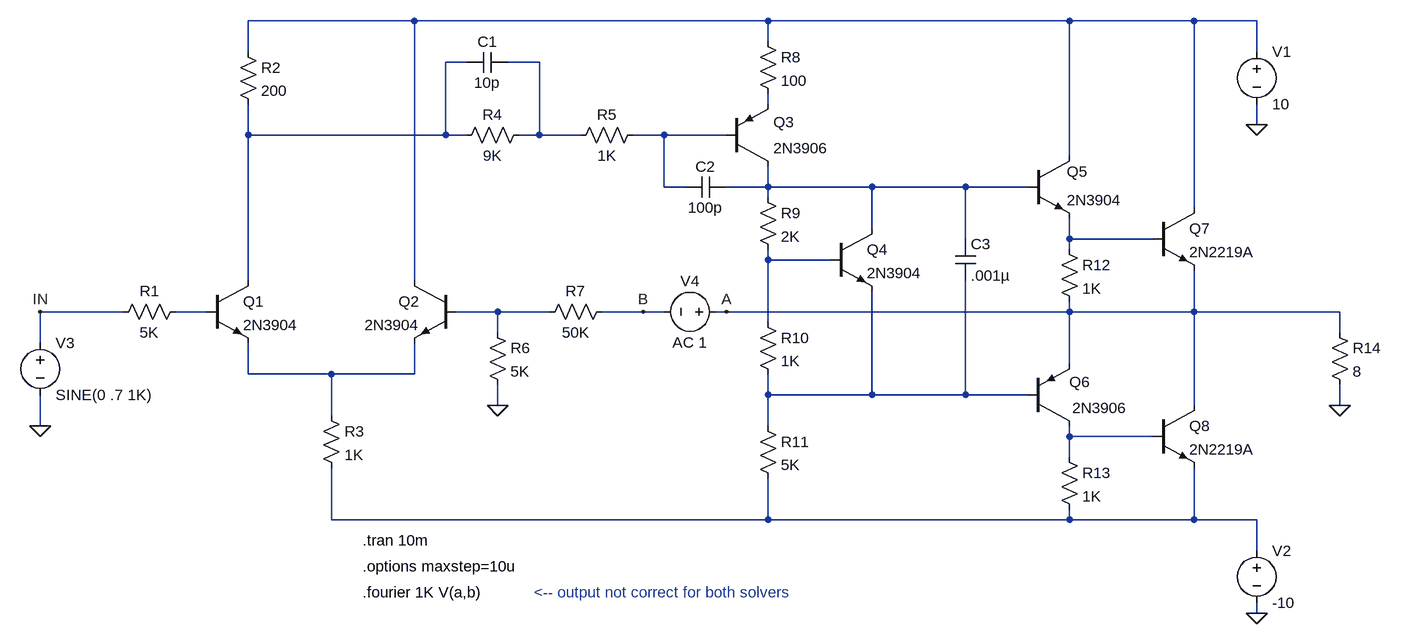
[diagram p0: schematic SolverIssue.asc]
SolverIssue.asc, the LTspice schematic file:
Version 4
SHEET 1 2352 2032
WIRE 848 912 592 912
WIRE 1392 912 848 912
WIRE 1856 912 1392 912
WIRE 2048 912 1856 912
WIRE 2144 912 2048 912
WIRE 1392 944 1392 912
WIRE 592 960 592 912
WIRE 2144 960 2144 912
WIRE 928 976 896 976
WIRE 1040 976 992 976
WIRE 1392 1040 1392 1024
WIRE 2144 1072 2144 1040
WIRE 592 1088 592 1040
WIRE 896 1088 896 976
WIRE 896 1088 592 1088
WIRE 928 1088 896 1088
WIRE 1040 1088 1040 976
WIRE 1040 1088 1008 1088
WIRE 1104 1088 1040 1088
WIRE 1232 1088 1184 1088
WIRE 1328 1088 1232 1088
WIRE 1856 1120 1856 912
WIRE 1232 1168 1232 1088
WIRE 1264 1168 1232 1168
WIRE 1392 1168 1392 1136
WIRE 1392 1168 1328 1168
WIRE 1552 1168 1392 1168
WIRE 1696 1168 1552 1168
WIRE 1792 1168 1696 1168
WIRE 1392 1184 1392 1168
WIRE 2048 1200 2048 912
WIRE 1552 1232 1552 1168
WIRE 1696 1248 1696 1168
WIRE 1856 1248 1856 1216
WIRE 1984 1248 1856 1248
WIRE 1856 1264 1856 1248
WIRE 1392 1280 1392 1264
WIRE 1488 1280 1392 1280
WIRE 592 1312 592 1088
WIRE 848 1312 848 912
WIRE 400 1360 272 1360
WIRE 528 1360 480 1360
WIRE 976 1360 912 1360
WIRE 1056 1360 976 1360
WIRE 1200 1360 1136 1360
WIRE 1232 1360 1200 1360
WIRE 1328 1360 1312 1360
WIRE 1856 1360 1856 1344
WIRE 1856 1360 1328 1360
WIRE 2048 1360 2048 1296
WIRE 2048 1360 1856 1360
WIRE 2272 1360 2048 1360
WIRE 1392 1376 1392 1280
WIRE 976 1392 976 1360
WIRE 2272 1392 2272 1360
WIRE 272 1408 272 1360
WIRE 1856 1440 1856 1360
WIRE 592 1456 592 1408
WIRE 720 1456 592 1456
WIRE 848 1456 848 1408
WIRE 848 1456 720 1456
WIRE 1392 1488 1392 1456
WIRE 1552 1488 1552 1328
WIRE 1552 1488 1392 1488
WIRE 1696 1488 1696 1312
WIRE 1696 1488 1552 1488
WIRE 1792 1488 1696 1488
WIRE 976 1504 976 1472
WIRE 2048 1504 2048 1360
WIRE 2272 1504 2272 1472
WIRE 720 1520 720 1456
WIRE 272 1536 272 1488
WIRE 1392 1536 1392 1488
WIRE 1856 1552 1856 1536
WIRE 1984 1552 1856 1552
WIRE 1856 1584 1856 1552
WIRE 720 1680 720 1600
WIRE 1392 1680 1392 1616
WIRE 1392 1680 720 1680
WIRE 1856 1680 1856 1664
WIRE 1856 1680 1392 1680
WIRE 2048 1680 2048 1600
WIRE 2048 1680 1856 1680
WIRE 2144 1680 2048 1680
WIRE 2144 1728 2144 1680
WIRE 2144 1824 2144 1808
FLAG 2144 1072 0
FLAG 2144 1824 0
FLAG 2272 1504 0
FLAG 976 1504 0
FLAG 272 1536 0
FLAG 1328 1360 A
FLAG 1200 1360 B
FLAG 272 1360 IN
SYMBOL NPN 1792 1120 R0
WINDOW 0 60 24 Left 2
WINDOW 3 60 68 Left 2
SYMATTR InstName Q5
SYMATTR Value 2N3904
SYMBOL npn 1984 1200 R0
SYMATTR InstName Q7
SYMATTR Value 2N2219A
SYMBOL npn 1984 1504 R0
SYMATTR InstName Q8
SYMATTR Value 2N2219A
SYMBOL PNP 1792 1536 M180
WINDOW 0 64 68 Left 2
WINDOW 3 68 28 Left 2
SYMATTR InstName Q6
SYMATTR Value 2N3906
SYMBOL VOLTAGE 2144 944 R0
SYMATTR InstName V1
SYMATTR Value 10
SYMBOL voltage 2144 1712 R0
SYMATTR InstName V2
SYMATTR Value -10
SYMBOL RES 1376 1520 R0
SYMATTR InstName R11
SYMATTR Value 5K
SYMBOL res 2256 1376 R0
SYMATTR InstName R14
SYMATTR Value 8
SYMBOL res 1376 1168 R0
SYMATTR InstName R9
SYMATTR Value 2K
SYMBOL res 1376 1360 R0
SYMATTR InstName R10
SYMATTR Value 1K
SYMBOL npn 1488 1232 R0
SYMATTR InstName Q4
SYMATTR Value 2N3904
SYMBOL npn 528 1312 R0
SYMATTR InstName Q1
SYMATTR Value 2N3904
SYMBOL npn 912 1312 M0
SYMATTR InstName Q2
SYMATTR Value 2N3904
SYMBOL res 576 944 R0
SYMATTR InstName R2
SYMATTR Value 200
SYMBOL res 704 1504 R0
SYMATTR InstName R3
SYMATTR Value 1K
SYMBOL pnp 1328 1136 M180
WINDOW 0 72 68 Left 2
WINDOW 3 72 28 Left 2
SYMATTR InstName Q3
SYMATTR Value 2N3906
SYMBOL res 960 1376 R0
SYMATTR InstName R6
SYMATTR Value 5K
SYMBOL res 1152 1344 R90
WINDOW 0 0 56 VBottom 2
WINDOW 3 32 56 VTop 2
SYMATTR InstName R7
SYMATTR Value 50K
SYMBOL voltage 272 1392 R0
SYMATTR InstName V3
SYMATTR Value SINE(0 .7 1K)
SYMBOL res 496 1344 R90
WINDOW 0 0 56 VBottom 2
WINDOW 3 32 56 VTop 2
SYMATTR InstName R1
SYMATTR Value 5K
SYMBOL res 1376 928 R0
SYMATTR InstName R8
SYMATTR Value 100
SYMBOL res 1024 1072 R90
WINDOW 0 0 56 VBottom 2
WINDOW 3 32 56 VTop 2
SYMATTR InstName R4
SYMATTR Value 9K
SYMBOL cap 1328 1152 R90
WINDOW 0 0 32 VBottom 2
WINDOW 3 32 32 VTop 2
SYMATTR InstName C2
SYMATTR Value 100p
SYMBOL cap 992 960 R90
WINDOW 0 0 32 VBottom 2
WINDOW 3 32 32 VTop 2
SYMATTR InstName C1
SYMATTR Value 10p
SYMBOL res 1840 1568 R0
SYMATTR InstName R13
SYMATTR Value 1K
SYMBOL res 1840 1248 R0
SYMATTR InstName R12
SYMATTR Value 1K
SYMBOL cap 1680 1248 R0
SYMATTR InstName C3
SYMATTR Value .001µ
SYMBOL res 1200 1072 R90
WINDOW 0 0 56 VBottom 2
WINDOW 3 32 56 VTop 2
SYMATTR InstName R5
SYMATTR Value 1K
SYMBOL voltage 1328 1360 R90
WINDOW 0 -32 56 VBottom 2
WINDOW 3 32 56 VTop 2
SYMATTR InstName V4
SYMATTR Value AC 1
TEXT 768 1712 Left 2 !.tran 10m
TEXT 768 1752 Left 2 !.options maxstep=10u
TEXT 768 1792 Left 2 !.fourier 1K V(a,b)
TEXT 1032 1792 Left 2 ;<-- output not correct for both solvers

The netlist it stands for:
* SolverIssue.asc
Q5 N001 N006 N007 0 2N3904
Q7 N001 N007 A 0 2N2219A
Q8 A N013 N014 0 2N2219A
Q6 N013 N012 A 0 2N3906
V1 N001 0 10
V2 N014 0 -10
R11 N012 N014 5K
R14 A 0 8
R9 N006 N008 2K
R10 N008 N012 1K
Q4 N006 N008 N012 0 2N3904
Q1 N002 N009 N011 0 2N3904
Q2 N001 N010 N011 0 2N3904
R2 N001 N002 200
R3 N011 N014 1K
Q3 N006 N005 N004 0 2N3906
R6 N010 0 5K
R7 B N010 50K
V3 IN 0 SINE(0 .7 1K)
R1 N009 IN 5K
R8 N001 N004 100
R4 N003 N002 9K
C2 N006 N005 100p
C1 N003 N002 10p
R13 N013 N014 1K
R12 N007 A 1K
C3 N006 N012 .001µ
R5 N005 N003 1K
V4 A B AC 1
.model NPN NPN
.model PNP PNP
.lib standard.bjt
.tran 10m
.options maxstep=10u
.fourier 1K V(a,b)
* <-- output not correct for both solvers
.backanno
.end